# Altium schematic sheet Flash.SchDoc
size 420 x 297 mm
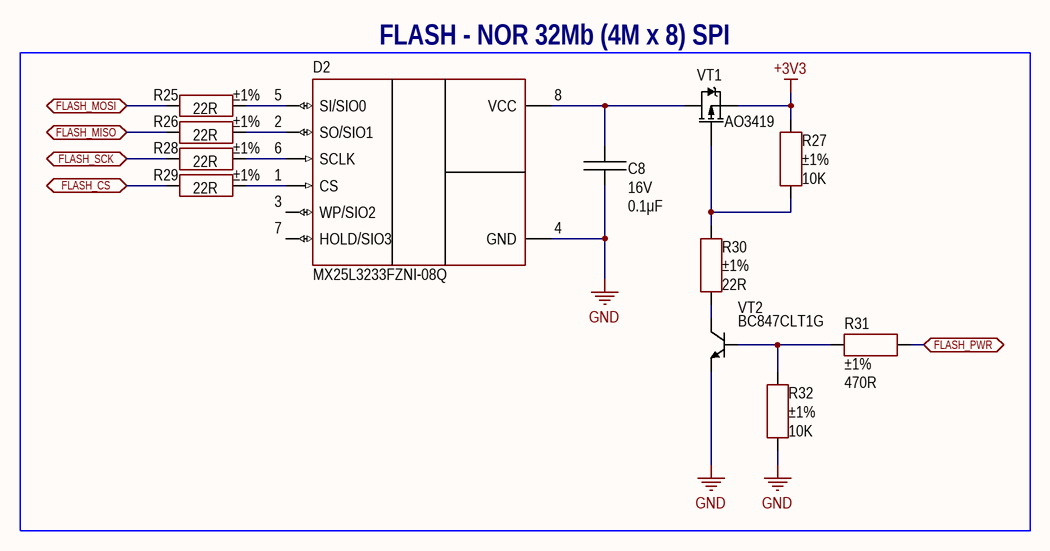
[diagram p0: Flash.SchDoc]

## Parts
C8  value 0.1μF  Voltage: 16V  [CAP: 0402]
D2  PartNumber: MX25L3233FZNI-08Q  [8-SOIC]
R25  value 22R  Tolerance: ±1%  [RES: 0402]
R26  value 22R  Tolerance: ±1%  [RES: 0402]
R27  value 10K  Tolerance: ±1%  [RES: 0402]
R28  value 22R  Tolerance: ±1%  [RES: 0402]
R29  value 22R  Tolerance: ±1%  [RES: 0402]
R30  value 22R  Tolerance: ±1%  [RES: 0402]
R31  value 470R  Tolerance: ±1%  [RES: 0402]
R32  value 10K  Tolerance: ±1%  [RES: 0402]
VT1  PartNumber: AO3419  [SOT23]
VT2  PartNumber: BC847CLT1G  [SOT23]

## Blocks framed on the sheet
FLASH - NOR 32Mb (4M x 8) SPI: C8 D2 R25-R32 VT1 VT2

## Ports
FLASH_CS (bidir), FLASH_MISO (bidir), FLASH_MOSI (bidir), FLASH_PWR (bidir), FLASH_SCK (bidir)

## Nets
+3V3: R27.2 VT1.2(S)
GND: C8.1 D2.4(GND) R32.1 VT2.2(E)
FLASH_CS: R29.1 ; port FLASH_CS
FLASH_MISO: R26.1 ; port FLASH_MISO
FLASH_MOSI: R25.1 ; port FLASH_MOSI
FLASH_PWR: R31.2 ; port FLASH_PWR
FLASH_SCK: R28.1 ; port FLASH_SCK
NetC8_2: C8.2 D2.8(VCC) VT1.3(D)
NetD2_1: D2.1(CS) R29.2
NetD2_2: D2.2(SO/SIO1) R26.2
NetD2_5: D2.5(SI/SIO0) R25.2
NetD2_6: D2.6(SCLK) R28.2
NetR27_1: R27.1 R30.2 VT1.1(G)
NetR30_1: R30.1 VT2.3(C)
NetR31_1: R31.1 R32.2 VT2.1(B)

Not connected (* = marked no-connect by the designer): D2 3(WP/SIO2) 7(HOLD/SIO3)

## Notes on the sheet
- Author
- Manufacturer
- Date
- Page
- Total pages
- Size page
- A3
- Materials

## Library data of the parts
C8 = Ceramic_0402: ±10% 16V Ceramic Capacitor X7R 0402 (1005 Metric); Manufacturer: Yageo; PartNumber: CC0402KRX7R7BB104; ValueManufacturerPartNumber: Ceramic capacitor, 0.1μF, X7R, ±10%, 16V, 0402, -55...+125°C; Package: 0402; HelpURL: https://www.digikey.com/product-detail/en/yageo/CC0402KRX7R7BB104/311-1338-1-ND/2103122; Temperature: -55...+125°C; TypeCapacitor: Ceramic capacitor; Tolerance: ±10%; TypeDielectric: X7R
D2 = MX25L3233: FLASH - NOR Memory IC 32Mb (8M x 4) SPI - Quad I/O 133 MHz 8-SOP; Manufacturer: Macronix; ValueManufacturerPartNumber: IC memory, FLASH, 32Mb (8M x 4), 133 MHz, SPI/QuadSPI, 2.7...3.6V, -40...+85°C, 8-SOIC; Supply: 2.7...3.6V; Speed: 133 MHz; InterfaceData: SPI/QuadSPI; HelpURL: https://www.digikey.com/en/products/detail/macronix/MX25L3233FM2I-08Q/7402342; Package: 8-SOIC; ComponentType: IC memory; Temperature: -40...+85°C; MemorySize: 32Mb (8M x 4); MemoryType: FLASH
R25 R26 R28-R30 = Resistor_0402: 22 Ohms ±1% 0.063W, 1/16W Chip Resistor 0402 (1005 Metric) Moisture Resistant Thick Film; Manufacturer: Yageo; PartNumber: RC0402FR-0722RL; ValueManufacturerPartNumber: Resistor film, 22R, ±1%, 0402, 0.063W, -55...+125°C; TypeResistor: Resistor film; Package: 0402; HelpURL: https://www.digikey.com/en/products/detail/yageo/RC0402FR-0722RL/726562; Temperature: -55...+125°C; Power: 0.063W
R27 R32 = Resistor_0402: 10 kOhms ±1% 0.063W, 1/16W Chip Resistor 0402 (1005 Metric) Moisture Resistant Thick Film; Manufacturer: Yageo; PartNumber: RC0402FR-0710KL; ValueManufacturerPartNumber: Resistor film, 10K, ±1%, 0402, 0.063W, -55...+125°C; TypeResistor: Resistor film; Package: 0402; HelpURL: https://www.digikey.com/en/products/detail/yageo/RC0402FR-0710KL/726523; Temperature: -55...+125°C; Power: 0.063W
R31 = Resistor_0402: 470 Ohms ±1% 0.063W, 1/16W Chip Resistor 0402 (1005 Metric) Moisture Resistant Thick Film; Manufacturer: Yageo; PartNumber: RC0402FR-07470RL; ValueManufacturerPartNumber: Resistor film, 470R, ±1%, 0402, 0.063W, -55...+125°C; TypeResistor: Resistor film; Package: 0402; HelpURL: https://www.digikey.com/en/products/detail/yageo/RC0402FR-07470RL/726619; Temperature: -55...+125°C; Power: 0.063W
VT1 = MOSFET_P_132: P-Channel 20 V 3.5A (Ta) 1.4W (Ta) Surface Mount SOT-23-3; Manufacturer: Alpha & Omega Semiconductor; ValueManufacturerPartNumber: MOSFET P-channel transistor, 20V, 3.5A, 4.4nC, 2.5W, 85mOhm, 400pF, SOT-23-3, -55...+150°C; TypeTransistor: MOSFET P-channel transistor; VoltageDS: 20V; RDS: 85mOhm; GateCharge: 4.4nC; InputCapacitor: 400pF; MaxPower: 2.5W; Package: SOT-23-3; HelpURL: https://www.digikey.com/product-detail/en/infineon-technologies/BSC340N08NS3GATMA1/BSC340N08NS3GATMA1TR-ND/2080655; Temperature: -55...+150°C; CurrentDS: 3.5A
VT2 = BJT_NPN_132: Bipolar (BJT) Transistor NPN 45 V 100 mA 100MHz 300 mW Surface Mount SOT-23-3 (TO-236); Manufacturer: ON Semiconductor; ValueManufacturerPartNumber: NPN transistor, 45V, 100mA, 100MHz, 300mW, 0.6V, 420, SOT-23, -55...+125°C; TypeTransistor: NPN transistor; VoltageCE: 45V; CurrentCE: 100mA; VoltageSaturation: 0.6V; CurrentGain: 420; MaxPower: 300mW; Package: SOT-23; HelpURL: https://www.digikey.com/product-detail/en/on-semiconductor/BC847CLT1G/BC847CLT1GOSCT-ND/917836; Temperature: -55...+125°C; Frequency: 100MHz